# EAGLE design pyIMU_v1 (EAGLE 6.5.0)
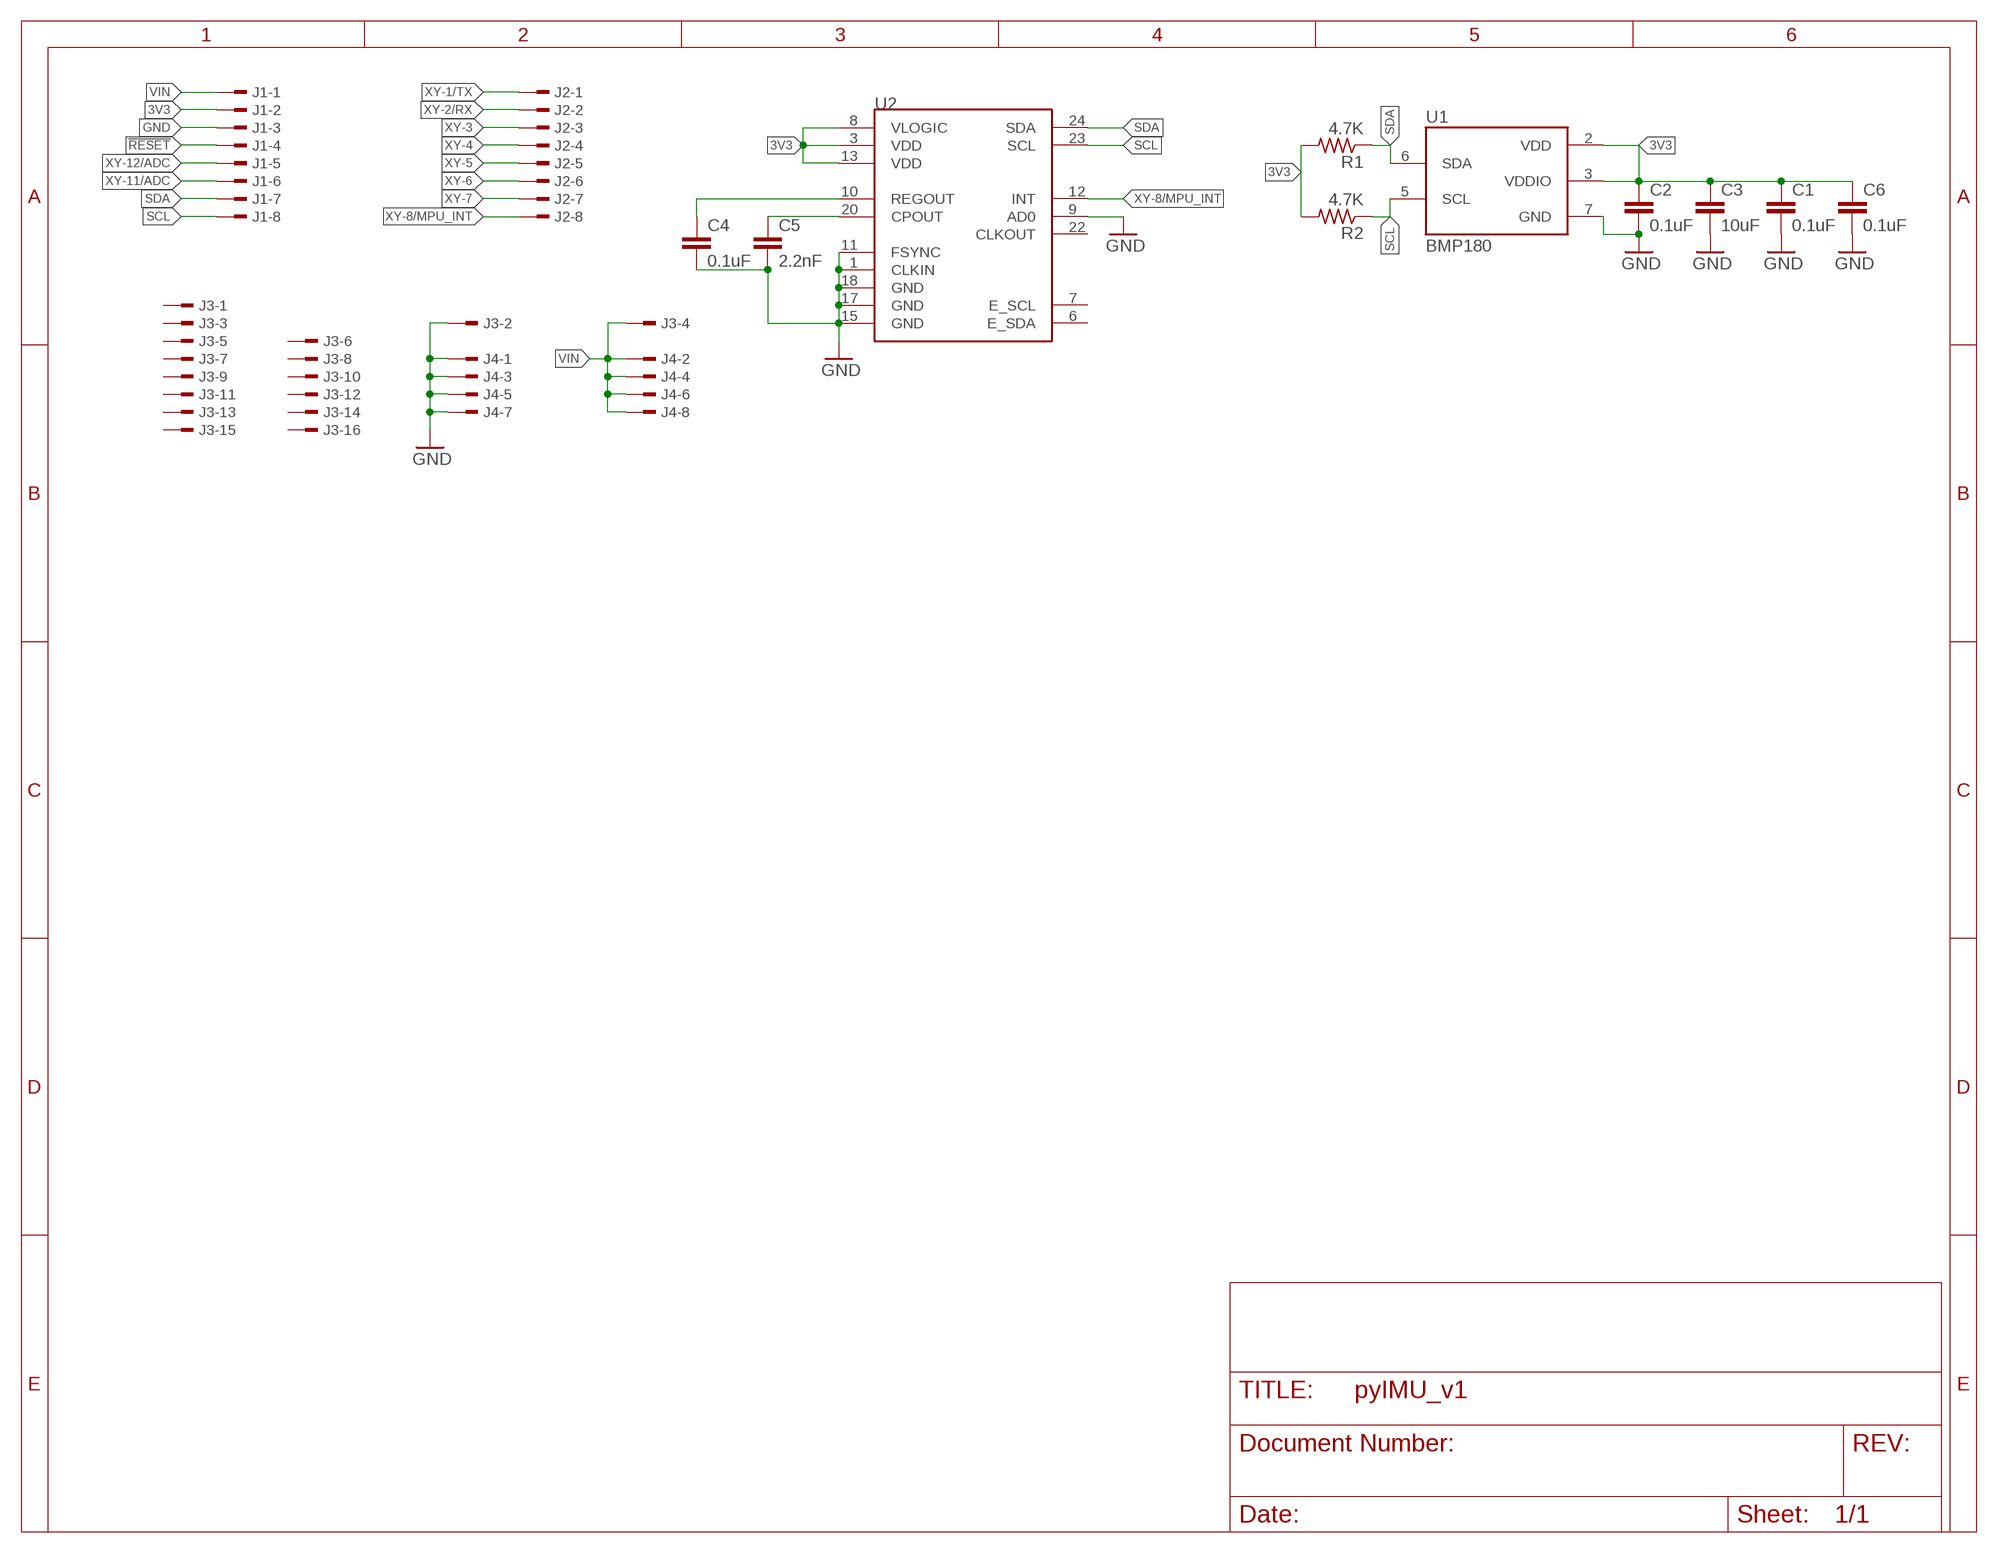
[diagram p0: schematic, sheet 1]

## Parts
C1  0.1uF  C-EUC0603K  [C0603K]
C2  0.1uF  C-EUC0603K  [C0603K]
C3  10uF  C-EUC0603K  [C0603K]
C4  0.1uF  C-EUC0603K  [C0603K]
C5  2.2nF  C-EUC0603K  [C0603K]
C6  0.1uF  C-EUC0603K  [C0603K]
J1  TSW-108-02-S-S-MOD  [TSW-108-02-S-S-MOD]
J2  TSW-108-02-S-S-MOD  [TSW-108-02-S-S-MOD]
J3  TSW-108-02-S-D-MOD  [TSW-108-02-S-D-MOD]
J4  TSW-104-02-S-D-MOD  [TSW-104-02-S-D-MOD]
R1  4.7K  R-US_R0603  [R0603]
R2  4.7K  R-US_R0603  [R0603]
U1  BMP180  [BMP180]
U2  MPU-9150QFN-24-NP  [QFN-24-NP]

## Nets
3V3: C1.1 C2.1 C3.1 C6.1 J1.2 R1.2 R2.2 U1.2(VDD) U1.3(VDDIO) U2.3(VDD) U2.8(VLOGIC) U2.13(VDD)
!RESET: J1.4
GND: C1.2 C2.2 C3.2 C4.2 C5.2 C6.2 J1.3 J3.2 J4.1 J4.3 J4.5 J4.7 U1.7(GND) U2.1(CLKIN) U2.9(AD0) U2.11(FSYNC) U2.15(GND) U2.17(GND) U2.18(GND)
N$1: C4.1 U2.10(REGOUT)
N$2: C5.1 U2.20(CPOUT)
SCL: J1.8 R2.1 U1.5(SCL) U2.23(SCL)
SDA: J1.7 R1.1 U1.6(SDA) U2.24(SDA)
VIN: J1.1 J3.4 J4.2 J4.4 J4.6 J4.8
XY-1/TX: J2.1
XY-2/RX: J2.2
XY-3: J2.3
XY-4: J2.4
XY-5: J2.5
XY-6: J2.6
XY-7: J2.7
XY-8/MPU_INT: J2.8 U2.12(INT)
XY-11/ADC: J1.6
XY-12/ADC: J1.5
Unconnected: J3.1 J3.3 J3.5 J3.6 J3.7 J3.8 J3.9 J3.10 J3.11 J3.12 J3.13 J3.14 J3.15 J3.16 U2.6(E_SDA) U2.7(E_SCL) U2.22(CLKOUT)

## Library data of the parts
C1-C6 = rcl:C-EU: CAPACITOR, European symbol
J1 J2 = pyIMU-03:TSW-108-02-S-S: THROUGH-HOLE .025" SQ POST HEADER Source: Samtec TSW.pdf
J3 = pyIMU-03:TSW-108-02-S-D: THROUGH-HOLE .025" SQ POST HEADER Source: Samtec TSW.pdf
J4 = pyIMU-03:TSW-104-02-S-D: THROUGH-HOLE .025" SQ POST HEADER Source: Samtec TSW.pdf
R1 R2 = rcl:R-US_: RESISTOR, American symbol
U1 = SparkFun-Sensors:BMP180: BOSCH BMP180 DIGITAL BAROMETRIC PRESSURE SENSOR Web page: http://www.bosch-sensortec.com/en/homepage/products_3/environmental_sensors_1/bmp180_1/bmp180 Datasheet: http://ae-bst.resource.bosch.com/media/products/dokumente/bmp180/BST-BMP180-DS000-09.pdf The BMP180 is the function compatible successor of the BMP085, a new generation of high precision digital pressure sensors for consumer applications. The ultra-low power, low voltage electronics of the BMP180 is optimized for use in mobile phones, PDAs, GPS navigation devices and outdoor equipment. With a low altitude noise of merely 0.25m at fast conversion time, the BMP180 offers superior performance. The I2C interface allows for easy system integration with a microcontroller. The BMP180 is based on piezo-resistive technology for EMC robustness, high accuracy and linearity as well as long term stability. Key features: - Temperature measurement included - I2C interface - Fully calibrated - Pb-free, halogen-free and RoHS compliant, - MSL 1 Basic specs: Pressure range: 300 to 1100hPa (+9000m to -500m relating to sea level) Supply voltage: 1.8 to 3.6V (VDD), 1.62V to 3.6V (VDDIO) Package: LGA package with metal lid Small footprint: 3.6mm x 3.8mm Super-flat: 0.93mm height Low power: 5μA at 1 sample / sec. in standard mode Low noise: 0.06hPa (0.5m) in ultra low power mode, 0.02hPa (0.17m) advanced resolution mode Typical applications: - Enhancement of GPS navigation (dead-reckoning, slope detection, etc.) - In- and out-door navigation - Leisure and sports - Weather forecast - Vertical velocity indication (rise/sink speed)
U2 = SparkFun-Sensors:MPU-9150: 9DOF (3mag, 3accel, 3rotat). I2C interface.

## Net classes
0 default: clearance 0.205 mm

## Board
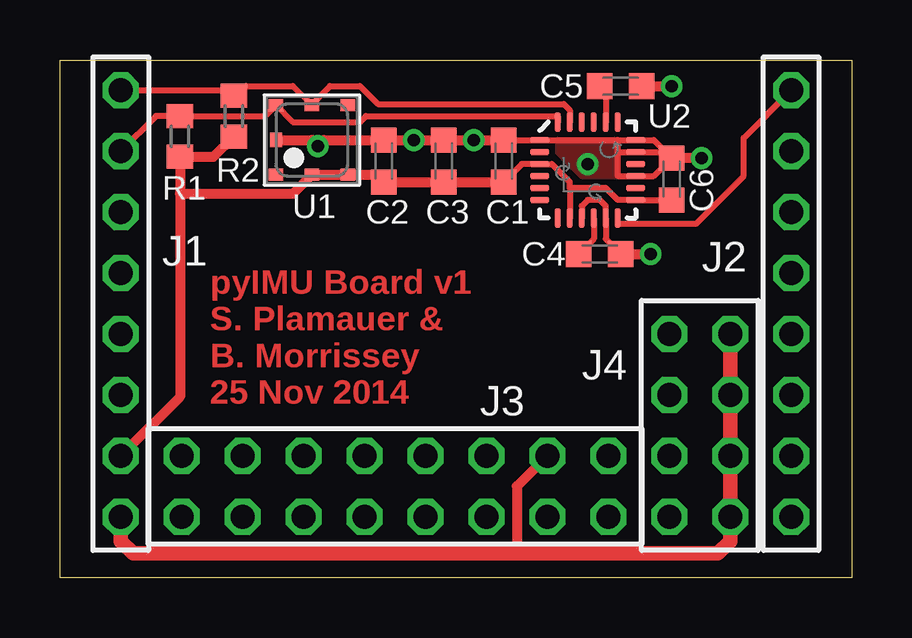
[diagram p1: board, top side]
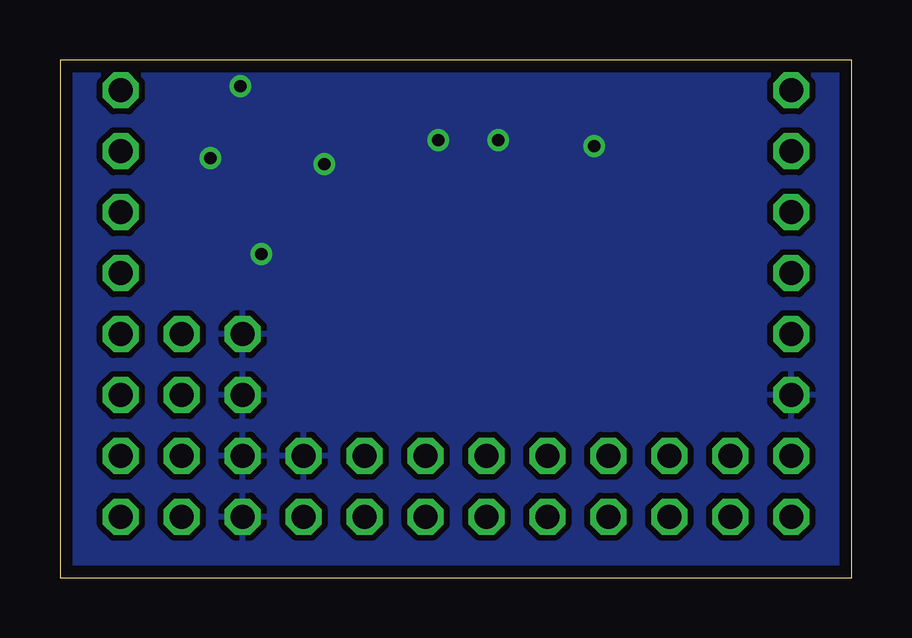
[diagram p2: board, bottom side, seen from below]

Size 33.02 x 21.59 mm. Coordinates in mm from the lower left corner, seen from the top.
Outline: 0,21.59 33.02,21.59 33.02,0 0,0 0,21.59
Copper layers (1*16): Top 0.0178mm / dielectric 59mil / Bottom 0.0178mm
Design rules "SSC-EAGLE-2Lyr_v1.0.0.3": minimum track width 6mil, minimum drill 14mil, track to track 6mil, track to pad 6mil, pad to pad 6mil, via to via 6mil, smd to smd 6mil, copper to edge 20mil, drill to drill 16mil, minimum pad ring 8mil, minimum via ring 8mil, stop-mask expansion 3mil, vias tented up to drill 0mil, thermal gap 10mil

### Footprints (pad centres in the part's own frame; a part is rotated, then mirrored left to right if it is on the bottom)
C0603K = smd 1.05 x 1.08: 1 -0.875,0; 2 0.875,0
TSW-108-02-S-S-MOD = drill 1 pad 1.5 octagon: 1 8.89,0; 2 6.35,0; 3 3.81,0; 4 1.27,0; 5 -1.27,0; 6 -3.81,0; 7 -6.35,0; 8 -8.89,0
TSW-108-02-S-D-MOD = drill 1 pad 1.5 octagon: 1 8.89,-1.27; 2 8.89,1.27; 3 6.35,-1.27; 4 6.35,1.27; 5 3.81,-1.27; 6 3.81,1.27; 7 1.27,-1.27; 8 1.27,1.27; 9 -1.27,-1.27; 10 -1.27,1.27; 11 -3.81,-1.27; 12 -3.81,1.27; 13 -6.35,-1.27; 14 -6.35,1.27; 15 -8.89,-1.27; 16 -8.89,1.27
TSW-104-02-S-D-MOD = drill 1 pad 1.5 octagon: 1 3.81,-1.27; 2 3.81,1.27; 3 1.27,-1.27; 4 1.27,1.27; 5 -1.27,-1.27; 6 -1.27,1.27; 7 -3.81,-1.27; 8 -3.81,1.27
R0603 = smd 1 x 1.1: 1 -0.85,0; 2 0.85,0
BMP180 = smd 0.6 x 0.5: 1 1.5,1.45; 2 0,1.45; 3 -1.5,1.45; 4 -1.5,-1.45; 5 0,-1.45; 6 1.5,-1.45 | smd 0.5 x 0.6: 7 1.5,0
QFN-24-NP = smd 0.8 x 0.254: 1 -2,1.25; 2 -2,0.75; 3 -2,0.25; 4 -2,-0.25; 5 -2,-0.75; 6 -2,-1.25; 13 2,-1.25; 14 2,-0.75; 15 2,-0.25; 16 2,0.25; 17 2,0.75; 18 2,1.25 | smd 0.254 x 0.8: 7 -1.25,-2; 8 -0.75,-2; 9 -0.25,-2; 10 0.25,-2; 11 0.75,-2; 12 1.25,-2; 19 1.25,2; 20 0.75,2; 21 0.25,2; 22 -0.25,2; 23 -0.75,2; 24 -1.25,2

### Placement (x,y rotation side)
C1  18.5,17.38 90 top
C2  13.5,17.38 90 top
C3  16,17.38 90 top
C4  22.5,13.5 0 top
C5  23.38,20.5 0 top
C6  25.5,16.62 90 top
J1  2.54,11.43 270 top
J2  30.48,11.43 270 top
J3  13.97,3.81 0 top
J4  26.67,6.35 270 top
R1  5,18.4 270 top
R2  7.25,19.25 270 top
U1  10.5,18.25 180 top
U2  22,17 0 top

### Tracks (layer width: path | path; a pad name or v marks a point on that pad's centre or on a via)
3V3
  Top 0.254: 21.25,16.25 U2.8 | 21.25,16.25 22.75,16.25 23.25,15.75 U2.13 C6.1 | 21.25,16.25 21.25,16.5 20.5,17.25 U2.3 19.25,17.25 C1.1
  Top 0.406: 5,16 R1.2 6.4,17.55 R2.2 | 5,16 5,7.54 J1.2 | 5,16 9.7,16 U1.2 U1.3 13.2,16.8 C2.1 C3.1 C1.1
GND  (via drill 0.51)
  Top 0.254: C4.2 22.75,14.12 U2.11 22.75,15.5 22.5,15.75 22,15.75 21.75,15.5 U2.9 | 25.25,17.75 U2.17 23.25,17.75 | 25.25,17.75 24.75,18.25 U2.18 23.25,18.25 | 25.25,17.75 C6.2 24.75,16.75 U2.15 23.25,16.75 23.25,17.75 | 23.25,18.25 U2.1 C1.2 | 23.25,17.75 23.25,18.25
  Top 0.406: C1.2 v17.25,18.25 C3.2 v14.75,18.25 C2.2 11,18.25 v10.75,18 10.5,18.25 U1.7 | v26.75,17.5 C6.2 | C4.2 v24.62,13.5 | C5.2 v25.5,20.5
  other vias: 22,17.25
  pour Bottom (isolate 0.254): 0.25,0.25 32.77,0.25 32.77,21.36 0.25,21.36
  pour Top (no thermals): 20.75,18.25 20.75,17.75 21.75,16.75 23.25,16.75 23.25,18.25
N$1
  Top 0.254: U2.10 22.25,14.12 C4.1
N$2
  Top 0.254: C5.1 22.75,20.25 U2.20
SCL
  Top 0.254: U2.23 21.25,19.5 21,19.75 13.25,19.75 12.5,20.5 11.25,20.5 10.5,19.75 U1.5 9.7,20.5 7.75,20.5 7.35,20.1 R2.1 7.03,20.32 J1.8
SDA
  Top 0.254: U2.24 20.75,19.25 12.75,19.25 12.5,19 9.7,19 U1.6 8.55,19.25 R1.1 4.01,19.25 J1.7
VIN
  Top 0.406: J3.4 19.05,3.81 19.05,1.27 19.3,1.02
  Top 0.61: J4.8 J4.6 J4.4 J4.2 27.94,1.52 27.43,1.02 19.3,1.02 3.05,1.02 2.54,1.52 J1.1
XY-8/MPU_INT
  Top 0.254: U2.12 23.25,14.75 26.5,14.75 28.5,16.75 28.5,18.34 J2.8

### Text on the board
Top: pyIMU Board v1 / S. Plamauer & / B. Morrissey / 25 Nov 2014